# Altium schematic sheet RADC-Power-S04-V00.SchDoc
size A3; SheetNumber: 5; SheetTotal: 7; Version: 00; Project: ####; PageSetup: Record=PageOptions|CenterHorizontal=True|CenterVertical=True|PrintScale=0.97|XCorrection=1.00|YCorrection=1.00|PrintKind=0|BorderSize=5000000|LeftOffset=0|BottomOffset=0|Orientation=2|PaperLength=1000|PaperWidth=1000|Scale=100|PaperSource=7|PrintQuality=-4|MediaType=1|DitherType=10|PaperKind=A4|PrintScaleMode=1
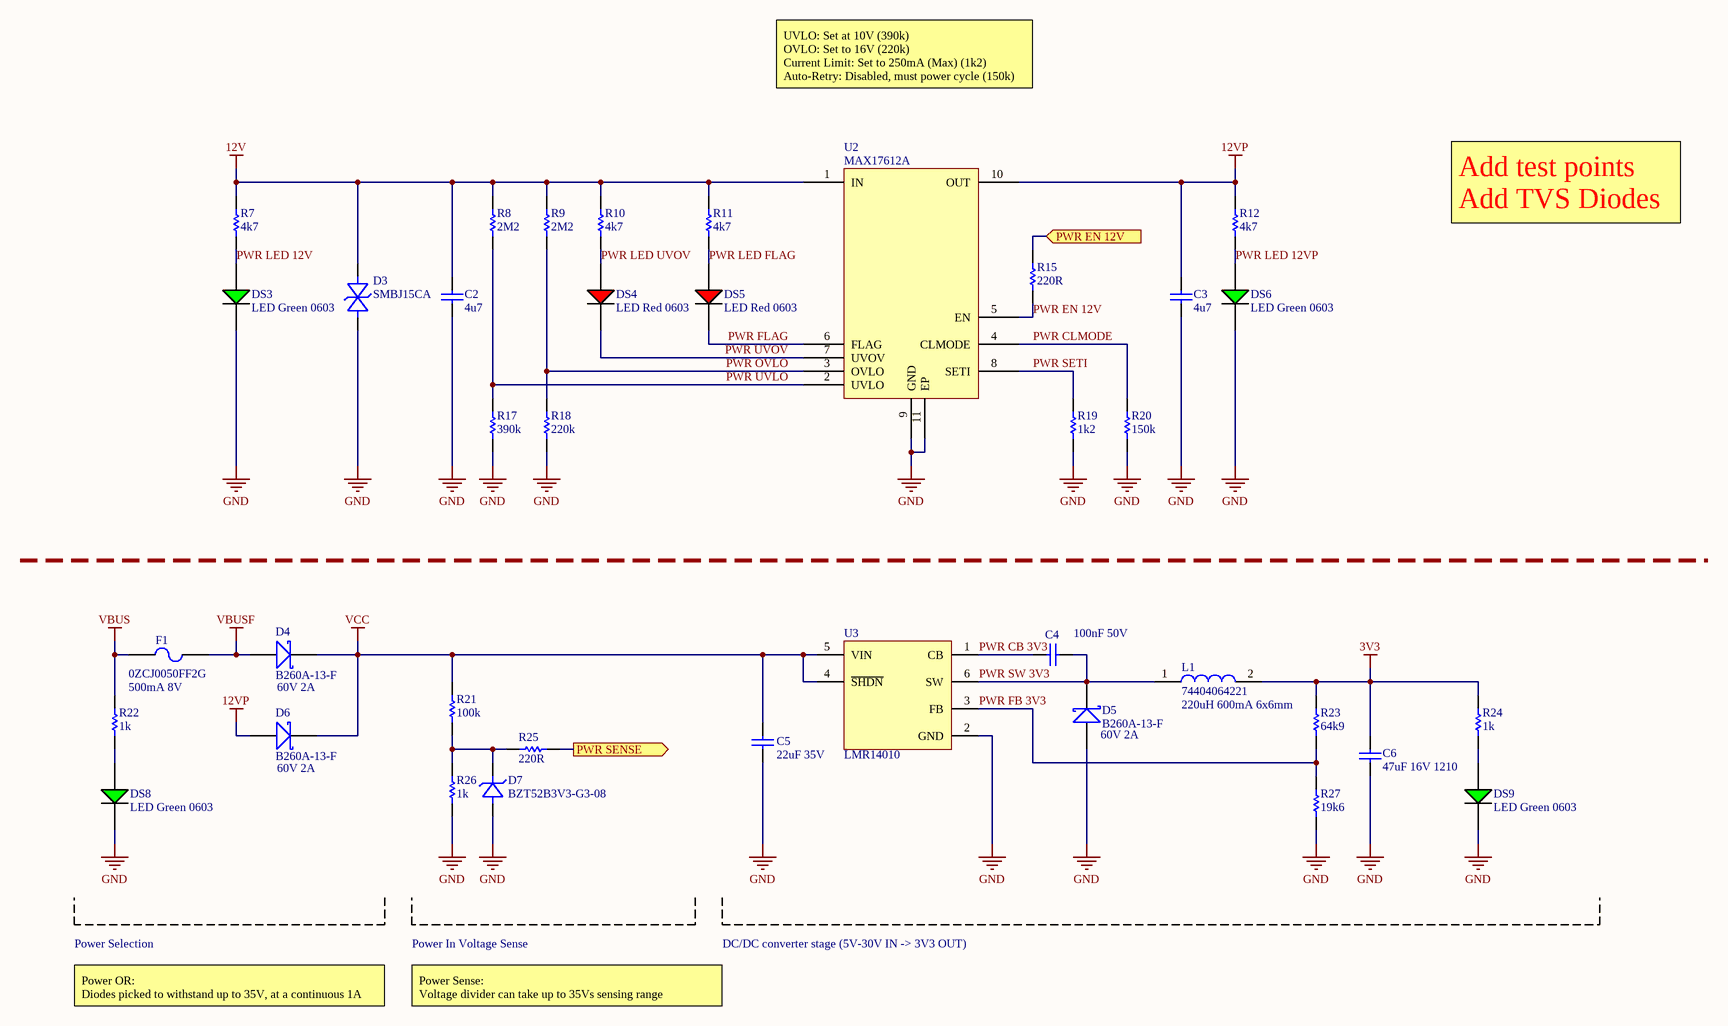
[diagram p0: RADC-Power-S04-V00.SchDoc]

## Parts
C2  4u7  [Cap_Ceramic_0603]
C3  4u7  [Cap_Ceramic_0603]
C4  100nF 50V  [Cap_Ceramic_0603]
C5  22uF 35V  [Cap_Ceramic_1206]
C6  47uF 16V 1210  [Cap_Ceramic_1210]
D3  SMBJ15CA  [SMB]
D4  B260A-13-F  [SMA]
D5  B260A-13-F  [SMA]
D6  B260A-13-F  [SMA]
D7  BZT52B3V3-G3-08  [SOD123]
DS3  LED Green 0603  [LED GREEN 0603]
DS4  LED Red 0603  [LED RED 0603]
DS5  LED Red 0603  [LED RED 0603]
DS6  LED Green 0603  [LED GREEN 0603]
DS8  LED Green 0603  [LED GREEN 0603]
DS9  LED Green 0603  [LED GREEN 0603]
F1  0ZCJ0050FF2G  [1206 Fuse]
L1  74404064221  [Inductor_6x6mm]
R7  4k7  [Res_ThinFilm_0603]
R8  2M2  [Res_ThinFilm_0603]
R9  2M2  [Res_ThinFilm_0603]
R10  4k7  [Res_ThinFilm_0603]
R11  4k7  [Res_ThinFilm_0603]
R12  4k7  [Res_ThinFilm_0603]
R15  220R  [Res_ThinFilm_0603]
R17  390k  [Res_ThinFilm_0603]
R18  220k  [Res_ThinFilm_0603]
R19  1k2  [Res_ThinFilm_0603]
R20  150k  [Res_ThinFilm_0603]
R21  100k  [Res_ThinFilm_0603]
R22  1k  [Res_ThinFilm_0603]
R23  64k9  [Res_ThinFilm_0603]
R24  1k  [Res_ThinFilm_0603]
R25  220R  [Res_ThinFilm_0603]
R26  1k  [Res_ThinFilm_0603]
R27  19k6  [Res_ThinFilm_0603]
U2  MAX17612A  [10-Pin TDFN EP]
U3  LMR14010  [LMR14010]

## Ports
PWR EN 12V (in), PWR SENSE (out)

## Nets
3V3: C6.2 L1.2 R23.2 R24.2
12V: C2.2 D3.A(Anode) R7.2 R8.2 R9.2 R10.2 R11.2 U2.1(IN)
12VP: C3.2 D6.A R12.2 U2.10(OUT)
GND: C2.1 C3.1 C5.1 C6.1 D3.K(Cathode) D5.A D7.A(Anode) DS3.2(C) DS6.2(C) DS8.2(C) DS9.2(C) R17.1 R18.1 R19.1 R20.1 R26.1 R27.1 U2.9(GND) U2.11(EP) U3.2(GND)
VBUS: F1.1 R22.2
VBUSF: D4.A F1.2
VCC: C5.2 D4.K D6.K R21.2 U3.4(~{SHDN}) U3.5(VIN)
PWR CB 3V3: C4.1 U3.1(CB)
PWR CLMODE: R20.2 U2.4(CLMODE)
PWR EN 12V: R15.1 U2.5(EN)
PWR EN 12V: R15.2 ; port PWR EN 12V  [a separate net that carries the same name]
PWR FB 3V3: R23.1 R27.2 U3.3(FB)
PWR FLAG: DS5.2(C) U2.6(FLAG)
PWR LED 12V: DS3.1(A) R7.1
PWR LED 12VP: DS6.1(A) R12.1
PWR LED FLAG: DS5.1(A) R11.1
PWR LED UVOV: DS4.1(A) R10.1
PWR OVLO: R9.1 R18.2 U2.3(OVLO)
PWR SENSE: R25.2 ; port PWR SENSE
PWR SETI: R19.2 U2.8(SETI)
PWR SW 3V3: C4.2 D5.K L1.1 U3.6(SW)
PWR UVLO: R8.1 R17.2 U2.2(UVLO)
PWR UVOV: DS4.2(C) U2.7(UVOV)
NetD7_K: D7.K(Cathode) R21.1 R25.1 R26.2
NetDS8_1: DS8.1(A) R22.1
NetDS9_1: DS9.1(A) R24.1

## Notes on the sheet
- UVLO: Set at 10V (390k)
  OVLO: Set to 16V (220k)
  Current Limit: Set to 250mA (Max) (1k2)
  Auto-Retry: Disabled, must power cycle (150k)
- Add test points
  Add TVS Diodes
- 500mA 8V
- 60V 2A
- (near L1) 220uH 600mA 6x6mm
- (near D6) 60V 2A
- (near D5) 60V 2A
- Power Selection
- Power OR:
  Diodes picked to withstand up to 35V, at a continuous 1A
- Power In Voltage Sense
- Power Sense:
  Voltage divider can take up to 35Vs sensing range
- DC/DC converter stage (5V-30V IN -> 3V3 OUT)
- Revision History:
- Sheet Title:
- Rev
- Date
- Description
- Project:
- Size:
- Drawn By:
- A3
- Number:
- Revision:
- Sheet
- Version:
- of
- QUT Motorsport
- O-120, Gardens Point
- 2 George Street
- Brisbane, QLD 4000
- Australia
- Print Date:
- Print Time:
- File Name:

## Library data of the parts
C2 C3 = 4u7 50V 5% X7R 0603: Capacitor, Ceramic, SMD, 4u7, 50V, 5%, X7R, 0603
C4 = 100nF 50V 5% X7R 0603: Capacitor, Ceramic, SMD, 100nF, 50V, 5%, X7R, 0603
C5 = 22uF 35V 20% X5R 1206: 22µF ±20% 35V Ceramic Capacitor X5R 1206 (3216 Metric); ComponentLink1Description: Digikey; ComponentLink1URL: https://www.digikey.com.au/product-detail/en/tdk-corporation/C3216X5R1V226M160AC/445-8045-1-ND/2792165; ComponentLink2Description: Datasheet; ComponentLink2URL: https://product.tdk.com/info/en/catalog/datasheets/mlcc_commercial_general_en.pdf
C6 = 47uF 16V 10% X7R 1210: Capacitor, Ceramic, SMD, 47uF, 16V, 5%, X7R, 1210
D3 = SMBJ15CA: Diode, SMD, TVS Diode, 15V 24.4V, DO214AA/SMB; ComponentLink1Description: Digikey; ComponentLink1URL: https://www.digikey.com.au/product-detail/en/littelfuse-inc/SMBJ15CA/SMBJ15CALFCT-ND/285983; ComponentLink2Description: Datasheet; ComponentLink2URL: https://www.littelfuse.com/~/media/electronics/datasheets/tvs_diodes/littelfuse_tvs_diode_smbj_datasheet.pdf.pdf
D4-D6 = B260A-13-F: Diode, Schottky Barrier Rectifier, 60 V, 2 A, B260A-13-F
D7 = BZT52B3V3-G3-08: Diode, SMD, Zenner, 3.3V, 2%, 410mW, SOD-123; ComponentLink1Description: Digikey; ComponentLink1URL: https://www.digikey.com.au/product-detail/en/vishay-semiconductor-diodes-division/BZT52B3V3-G3-08/BZT52B3V3-G3-08GICT-ND/8284035; ComponentLink2Description: Datasheet; ComponentLink2URL: https://www.vishay.com/docs/83340/bzt52g.pdf
F1 = 0ZCJ0050FF2G: Polymeric PTC Resettable Fuse 8V 500mA Ih Surface Mount 1206 (3216 Metric), Concave
L1 = 74404064221: FIXED IND 220UH 660MA 850 MOHM; ComponentLink1Description: Digikey; ComponentLink1URL: https://www.digikey.com.au/product-detail/en/w%C3%BCrth-elektronik/74404064221/732-7261-1-ND/5353241; ComponentLink2Description: LCSC A; ComponentLink2URL: https://lcsc.com/product-detail/Power-Inductors_Sunlord-SWPA6045S221MT_C91047.html; ComponentLink3Description: LCSC B; ComponentLink3URL: https://lcsc.com/product-detail/Power-Inductors_SXN-Shun-Xiang-Nuo-Elec-SMNR6045-221MT_C467145.html
R7 R10-R12 = 4k7 5% 0603: Resistor, SMD, 4k7, 0.1W, 5%, 0603
R8 R9 = 2M2 5% 0603: Resistor, SMD, 2M2, 0.1W, 5%, 0603
R15 R25 = 220R 5% 0603: Resistor, SMD, 220R, 0.1W, 5%, 0603
R17 = 390k 5% 0603: Resistor, SMD, 390k, 0.1W, 5%, 0603
R18 = 220k 5% 0603: Resistor, SMD, 220k, 0.1W, 5%, 0603
R19 = 1k2 5% 0603: Resistor, SMD, 1k2, 0.1W, 5%, 0603
R20 = 150k 5%, 0603: Resistor, SMD, 150k, 0.1W, 5%, 0603
R21 = 100k 5%, 0603: Resistor, SMD, 100k, 0.1W, 5%, 0603
R22 R24 R26 = 1k 5% 0603: Resistor, SMD, 1k, 0.1W, 5%, 0603
R23 = 64k9 1% 0603: Resistor, SMD, 64k9, 0.1W, 5%, 0603
R27 = 19k6 1% 0603: Resistor, SMD, 19k6, 0.1W, 5%, 0603
U2 = MAX17612A: Overvoltage, Undervoltage Protection PMIC 10-TDFN-EP (3x3)